# EAGLE design skyshieldv0.1 (EAGLE 7.2.0)
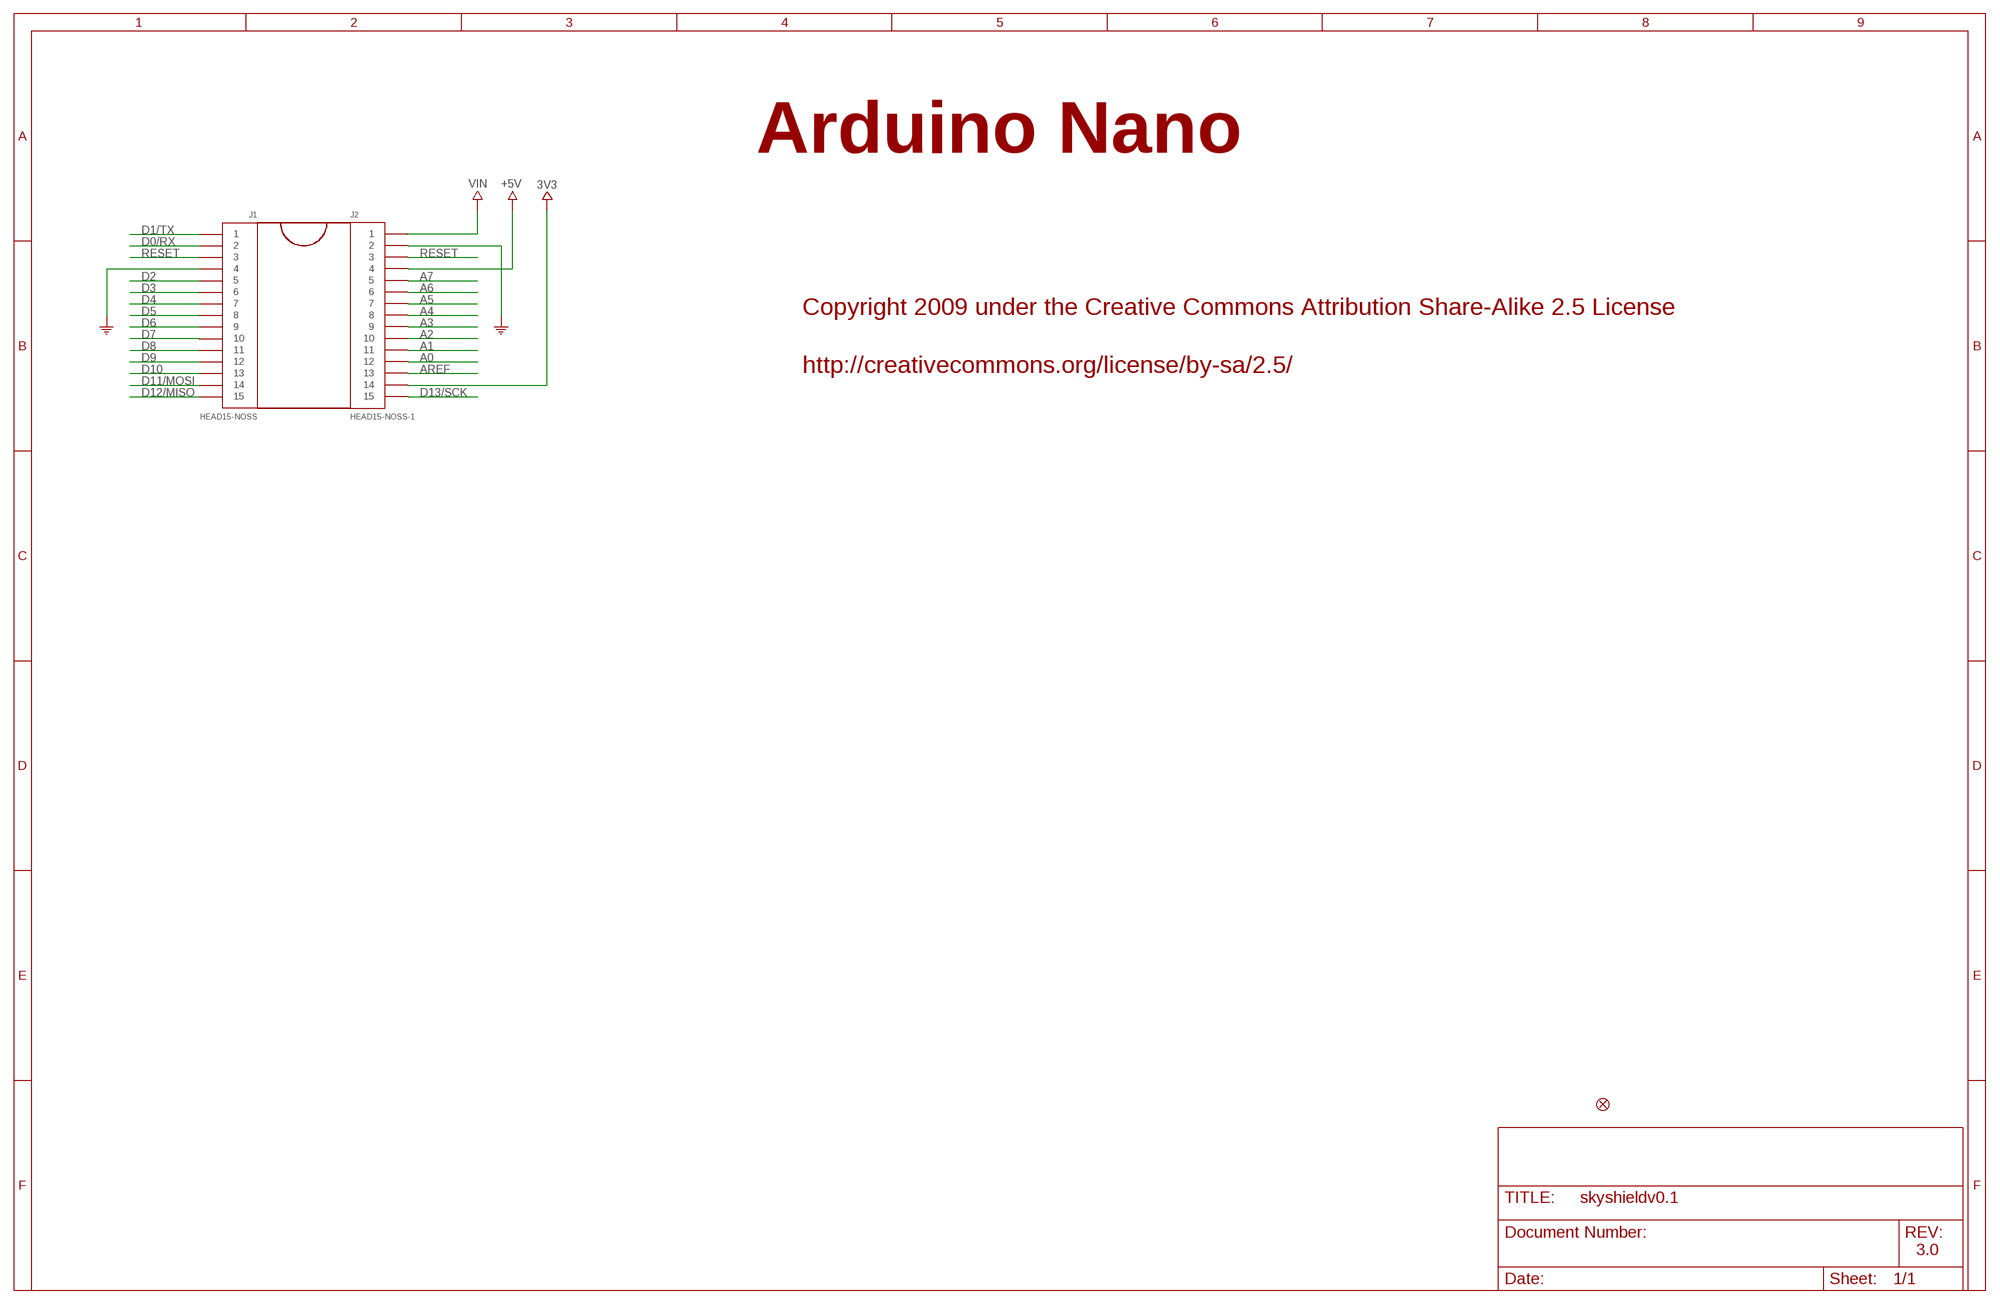
[diagram p0: schematic, sheet 1]

## Parts
J1  HEAD15-NOSS  [HEAD15-NOSS]
J2  HEAD15-NOSS-1  [HEAD15-NOSS-1]
U$54  FIDUCIAL1X2  [FIDUCIAL-1X2]

## Nets
3V3: J2.14
+5V: J2.4
A0: J2.12
A1: J2.11
A2: J2.10
A3: J2.9
A4: J2.8
A5: J2.7
A6: J2.6
A7: J2.5
AREF: J2.13
COM: J1.4 J2.2
D0/RX: J1.2
D1/TX: J1.1
D2: J1.5
D3: J1.6
D4: J1.7
D5: J1.8
D6: J1.9
D7: J1.10
D8: J1.11
D9: J1.12
D10: J1.13
D11/MOSI: J1.14
D12/MISO: J1.15
D13/SCK: J2.15
RESET: J1.3 J2.3
VIN: J2.1

## Notes on the sheet
- Arduino Nano
- Copyright 2009 under the Creative Commons Attribution Share-Alike 2.5 License
- http://creativecommons.org/license/by-sa/2.5/
- 3.0

## Library data of the parts
J1 = MyCON2:HEAD15-NOSS
J2 = MyCON2:HEAD15-NOSS-1
U$54 = SparkFun:FIDUCIAL: Fiducial Alignment Points Various fiducial points for machine vision alignment.

## Board
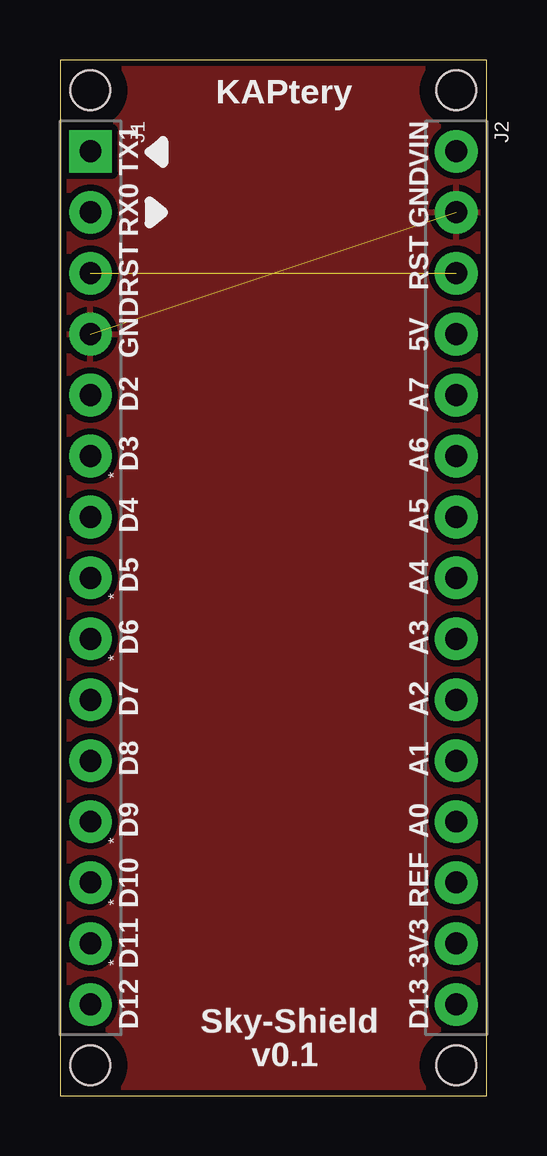
[diagram p1: board, top side]
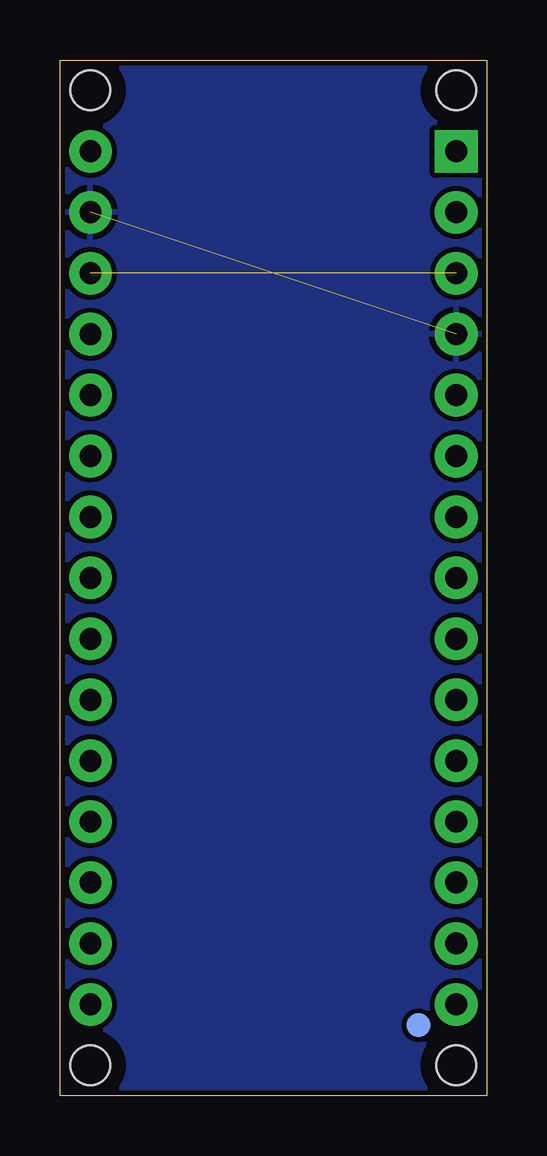
[diagram p2: board, bottom side, seen from below]

Size 17.78 x 43.18 mm. Coordinates in mm from the lower left corner, seen from the top.
Outline: 0,0 17.78,0 17.78,43.18 0,43.18 0,0
Copper layers (1*16): Top 0.035mm / dielectric 1.5mm / Bottom 0.035mm
Design rules "default *": minimum track width 8mil, minimum drill 16mil, track to track 8mil, track to pad 8mil, pad to pad 8mil, via to via 8mil, smd to smd 8mil, copper to edge 8mil, drill to drill 8mil, minimum pad ring 12mil, minimum via ring 8mil, stop-mask expansion 4mil, vias tented up to drill 18mil, thermal gap 10mil
Holes 1.65 mm at 1.27,1.27 16.51,1.27 16.51,41.91 1.27,41.91
tRestrict: area 0.1,0.1 to 2.4,2.4; area 15.4,40.8 to 17.7,43.1; area 15.4,0.1 to 17.7,2.4; area 0.1,40.8 to 2.4,43.1
bRestrict: area 15.4,0.1 to 17.7,2.4; area 0.1,0.1 to 2.4,2.4; area 0.1,40.8 to 2.4,43.1; area 15.4,40.8 to 17.7,43.1

### Footprints (pad centres in the part's own frame; a part is rotated, then mirrored left to right if it is on the bottom)
HEAD15-NOSS = drill 0.914 pad 1.778 square: 1 0,0 | drill 0.914 pad 1.778: 2 2.54,0; 3 5.08,0; 4 7.62,0; 5 10.16,0; 6 12.7,0; 7 15.24,0; 8 17.78,0; 9 20.32,0; 10 22.86,0; 11 25.4,0; 12 27.94,0; 13 30.48,0; 14 33.02,0; 15 35.56,0
HEAD15-NOSS-1 = drill 0.914 pad 1.778: 1 0,0; 2 2.54,0; 3 5.08,0; 4 7.62,0; 5 10.16,0; 6 12.7,0; 7 15.24,0; 8 17.78,0; 9 20.32,0; 10 22.86,0; 11 25.4,0; 12 27.94,0; 13 30.48,0; 14 33.02,0; 15 35.56,0
FIDUCIAL-1X2 = smd 1 x 1: 1 0,0

### Placement (x,y rotation side)
J1  1.27,39.37 270 top
J2  16.51,39.37 270 top
U$54  2.84,2.95 0 bottom

### Tracks (layer width: path | path; a pad name or v marks a point on that pad's centre or on a via)
COM  (1 unrouted)
  pour Top (isolate 0.254): 0.25,0.25 0.25,42.93 17.53,42.93 17.53,0.25
  pour Bottom (isolate 0.203): 0.25,0.25 0.25,42.93 17.53,42.93 17.53,0.25
RESET  (1 unrouted)

### Text on the board
tPlace: KAPtery | VIN | TX1 | RX0 | GND | RST | RST | GND | 5V | D2 | A7 | * | D3 | A6 | D4 | A5 | * | D5 | A4 | * | D6 | A3 | D7 | A2 | D8 | A1 | D9 | A0 | * | * | D10 | REF | * | D11 | 3V3 | Sky-Shield | D12 | D13 | v0.1